# EAGLE design GPSModule (EAGLE 6.3)
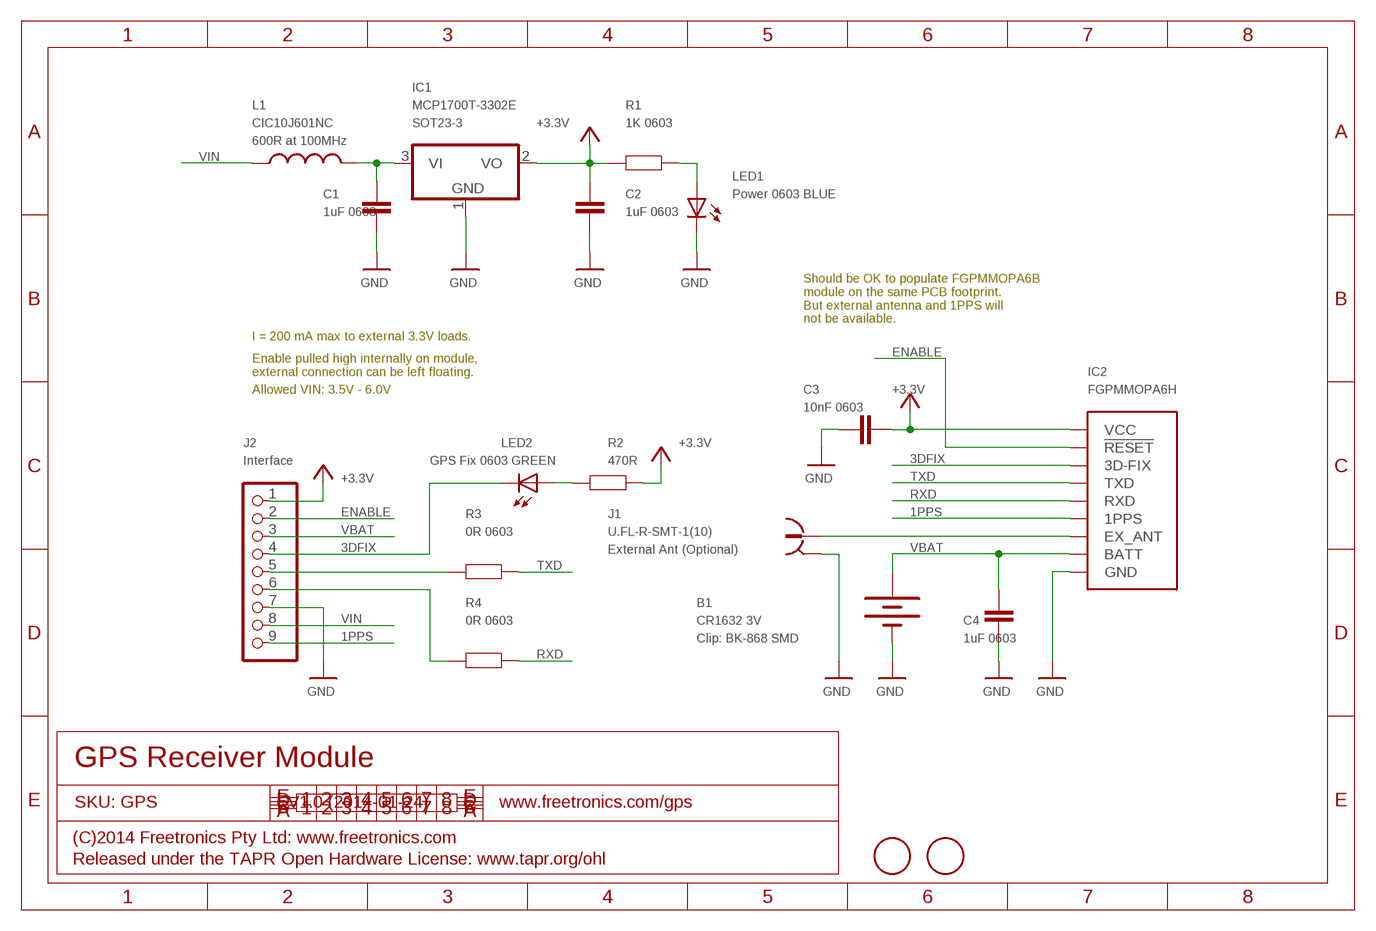
[diagram p0: schematic, sheet 1]

## Parts
B1  CR1632 3V  BATTERY  [BATCON_16MM]
C1  1uF 0603  CAP0603  [0603]
C2  1uF 0603  CAP0603  [0603]
C3  10nF 0603  CAP0603  [0603]
C4  1uF 0603  CAP0603  [0603]
FD1  FIDUCIAL  [FIDUCIAL_1MM]
FD2  FIDUCIAL  [FIDUCIAL_1MM]
IC1  MCP1700T-3302E  MCP1703CB  [SOT23]
IC2  FGPMMOPA6H  GPS  [GPS]
J1  U.FL-R-SMT-1(10)  UFL  [UFL]
J2  Interface  PINHD-1X9  [1X09]
L1  600R at 100MHz  INDUCTOR0603  [0603]
LED1  Power 0603 BLUE  LED0603  [LED-0603]
LED2  GPS Fix 0603 GREEN  LED0603  [LED-0603]
R1  1K 0603  RESISTOR0603  [0603]
R2  470R  RESISTOR0603  [0603]
R3  0R 0603  RESISTOR0603  [0603]
R4  0R 0603  RESISTOR0603  [0603]

## Nets
1PPS: IC2.13(1PPS) J2.9
3DFIX: IC2.5(3D-FIX) J2.4 LED2.C
+3V3: C2.2 C3.1 IC1.2(VO) IC2.1(VCC) J2.1 R1.2 R2.1 ; supply symbol labelled +3.3V
ENABLE: IC2.2(!RESET) J2.2
GND: B1.GND(-) C1.1 C2.1 C3.2 C4.1 IC1.1(GND) IC2.3(GND) IC2.8(GND) IC2.12(GND) IC2.19(GND) J1.GND J1.GND@1(GND) J2.7 LED1.C
N$1: J2.5 R3.2
N$2: IC2.11(EX_ANT) J1.SIG
N$3: LED1.A R1.1
N$4: LED2.A R2.2
N$5: C1.2 IC1.3(VI) L1.2
N$40: J2.6 R4.2
RXD: IC2.10(RXD) R4.1
TXD: IC2.9(TXD) R3.1
VBAT: B1.PWR@1(+) C4.2 IC2.4(BATT) J2.3
VIN: J2.8 L1.1

## Notes on the sheet
- Should be OK to populate FGPMMOPA6B
  module on the same PCB footprint.
  But external antenna and 1PPS will
  not be available.
- I = 200 mA max to external 3.3V loads.
- Enable pulled high internally on module,
  external connection can be left floating.
- Allowed VIN: 3.5V - 6.0V
- GPS Receiver Module
- SKU: GPS | V1.0 (2014-01-24) | www.freetronics.com/gps
- (C)2014 Freetronics Pty Ltd: www.freetronics.com
- Released under the TAPR Open Hardware License: www.tapr.org/ohl

## Library data of the parts
B1 = freetronics-master-v1:BATTERY: Battery Holders Various common sizes : AA, AAA, 20mm coin cell and 12mm coin cell.; FOO: Clip: BK-868 SMD
C1-C4 = freetronics-master-v1:CAP: Capacitor Standard 0603 ceramic capacitor, and 0.1" leaded capacitor.; PACKAGE: 0603
FD1 FD2 = adafruit:FIDUCIAL: For use by pick and place machines to calibrate the vision/machine, 1mm By microbuilder.eu
IC1 = linear:MCP1703: 250 mA, 16V, Low Quiescent Current LDO Regulator Source: http://ww1.microchip.com/downloads/en/DeviceDoc/22049b.pdf; PACKAGE: SOT23-3
IC2 = freetronics-luke:GPS
J1 = freetronics-luke:UFL: U.FL RF connector; NOTE: External Ant (Optional)
J2 = pinhead:PINHD-1X9: PIN HEADER
L1 = freetronics-master-v1:INDUCTOR: Inductors Basic Inductor/Choke - 0603 and 1206. Footprints are not proven and vary greatly between part numbers.; ID: CIC10J601NC
LED1 = freetronics-master-v1:LED: LEDs Standard schematic elements and footprints for 5mm, 3mm, 1206, and 0603 sized LEDs. 5mm - Spark Fun Electronics SKU : COM-00529 (and others); COLOUR: Blue; PACKAGE: 0603
LED2 = freetronics-master-v1:LED: LEDs Standard schematic elements and footprints for 5mm, 3mm, 1206, and 0603 sized LEDs. 5mm - Spark Fun Electronics SKU : COM-00529 (and others); COLOUR: Green; PACKAGE: 0603
R1-R4 = freetronics-master-v1:RESISTOR: Resistor Basic schematic elements and footprints for 0603, 1206, and PTH 1/10th watt (small) resistors.; PACKAGE: 0603

## Board
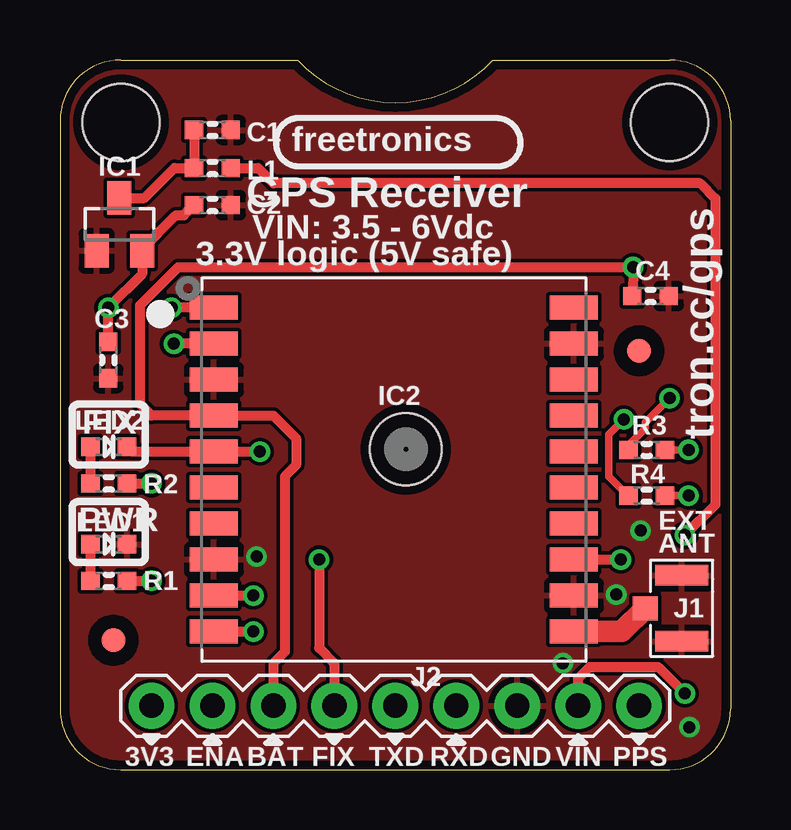
[diagram p1: board, top side]
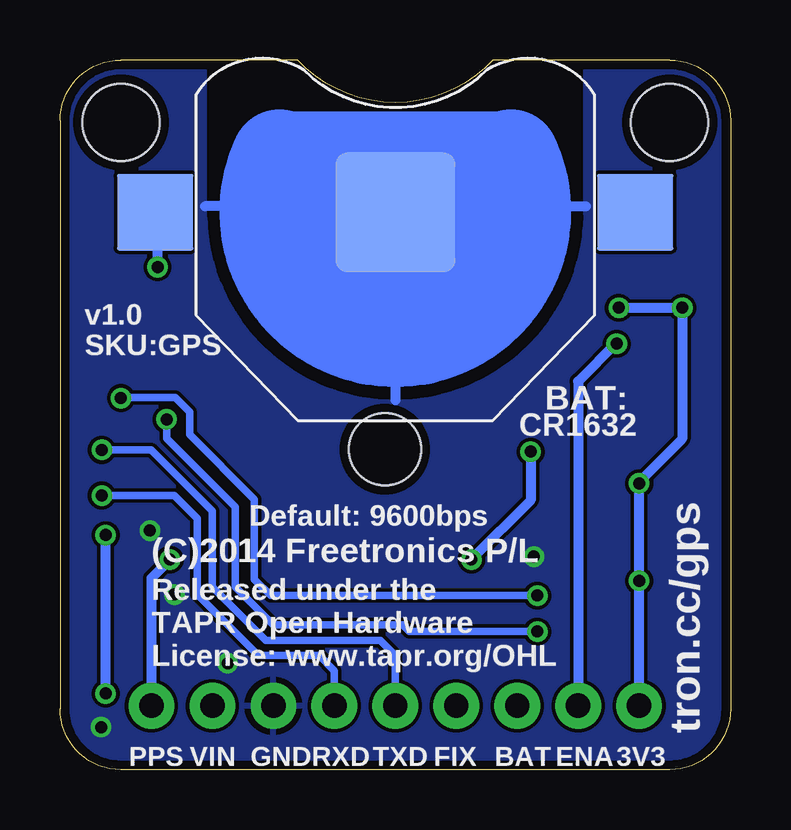
[diagram p2: board, bottom side, seen from below]

Size 27.94 x 29.59 mm. Coordinates in mm from the lower left corner, seen from the top.
Outline: 0,2.54 arc90 2.54,0 25.4,0 arc90 27.94,2.54 27.94,27.05 arc90 25.4,29.59 18.03,29.59 arc-47 13.97,27.81 arc-47 9.91,29.59 2.54,29.59 arc90 0,27.05 0,2.54
Copper layers (1*16): Top 0.0356mm / dielectric 1.5011mm / Bottom 0.0356mm
Design rules "LaenPCBOrder *": minimum track width 6mil, minimum drill 13mil, track to track 6mil, track to pad 6mil, pad to pad 6mil, via to via 6mil, smd to smd 6mil, copper to edge 15mil, drill to drill 6mil, minimum pad ring 7mil, minimum via ring 7mil, stop-mask expansion 4mil, vias tented up to drill 16mil, thermal gap 10mil
Holes 3.2 mm at 25.4,26.99 2.54,26.99
bRestrict: area 6.2,23 to 21.8,29.6; 1 lines

### Footprints (pad centres in the part's own frame; a part is rotated, then mirrored left to right if it is on the bottom)
BATCON_16MM = smd 5 x 5: GND 0,0 | smd 3.175 x 3.175: PWR@1 -10,0; PWR@2 10,0
0603 = smd 0.762 x 0.762: 1 -0.762,0; 2 0.762,0
FIDUCIAL_1MM = smd 1 x 1: 1 0,0
SOT23 = smd 1 x 1.4: 1 -0.95,-1.1; 2 0.95,-1.1; 3 0,1.1
GPS = smd 2 x 1: 1 -7.5,6.75; 2 -7.5,5.25; 3 -7.5,3.75; 4 -7.5,2.25; 5 -7.5,0.75; 6 -7.5,-0.75; 7 -7.5,-2.25; 8 -7.5,-3.75; 9 -7.5,-5.25; 10 -7.5,-6.75; 11 7.5,-6.75; 12 7.5,-5.25; 13 7.5,-3.75; 14 7.5,-2.25; 15 7.5,-0.75; 16 7.5,0.75; 17 7.5,2.25; 18 7.5,3.75; 19 7.5,5.25; 20 7.5,6.75 | hole 3: 0.5,0.85
UFL = smd 2.2 x 0.85: GND 0,1.375; GND@1 0,-1.375 | smd 1.05 x 1: SIG -1.525,0
1X09 = drill 1.016 pad 1.905: 1 -10.16,0; 2 -7.62,0; 3 -5.08,0; 4 -2.54,0; 5 0,0; 6 2.54,0; 7 5.08,0; 8 7.62,0; 9 10.16,0
LED-0603 = smd 0.762 x 0.762: A -0.762,0; C 0.762,0

### Placement (x,y rotation side)
B1  13.97,23.24 0 bottom
C1  6.35,26.67 180 top
C2  6.35,23.54 180 top
C3  2.01,17.08 270 top
C4  24.61,19.75 180 top
FD1  2.22,5.4 0 top
FD2  24.13,17.46 0 top
IC1  2.48,22.73 0 top
IC2  13.91,12.51 0 top
J1  25.91,6.73 0 top
J2  13.97,2.67 0 top
L1  6.35,25.08 180 top
LED1  2.03,9.4 0 top
LED2  2.03,13.46 0 top
R1  2.03,7.87 0 top
R2  2.03,11.94 180 top
R3  24.45,13.34 0 top
R4  24.45,11.43 0 top

### Tracks (layer width: path | path; a pad name or v marks a point on that pad's centre or on a via)
1PPS  (via drill 0.5)
  Top 0.406: IC2.13 v23.36,8.76
  Bottom 0.406: v23.36,8.76 23.36,8.74 24.13,7.98 J2.9
3DFIX  (via drill 0.5)
  Top 0.406: v8.33,13.26 IC2.5 3,13.26 LED2.C | v10.79,8.76 10.79,5.08 11.43,4.45 J2.4
  Bottom 0.406: v8.33,13.26 8.33,11.23 v10.79,8.76
+3V3  (via drill 0.5)
  Top 0.406: IC2.1 v4.65,19.26 | R1.2 v3.81,7.87 | R2.1 v3.81,11.94 | C3.1 v2.01,19.26 3.43,20.67 IC1.2 3.43,21.71 4.83,23.11 5.17,23.11 C2.2 5.55,23.5
  Bottom 0.406: v4.65,19.26 v2.01,19.26 2.01,13.8 3.81,12 v3.81,11.94 v3.81,7.87 J2.1
ENABLE  (via drill 0.5)
  Top 0.406: IC2.2 v4.74,17.76
  Bottom 0.406: v4.74,17.76 4.74,17.8 6.35,16.19 J2.2
GND  (via drill 0.5 pad 0.33)
  Bottom 0.254: 19.05,20.19 19.05,21.72 17.02,23.75
  Bottom 0.406: 9.14,25.53 10.92,23.75 | 10.92,23.75 13.21,23.75 | 18.8,25.53 17.02,23.75 | 10.92,23.75 10.41,23.75 10.16,23.5 13.72,23.5 B1.GND | 19.05,20.19 16.07,20.19 14.61,18.73 13.97,18.73 | 13.97,18.73 13.97,15.4 | 13.97,18.73 13.97,23.5 | 13.97,23.5 21.91,23.5 | 13.97,23.5 6.03,23.5
  Bottom 4: 9.14,25.53 arc230 18.8,25.53
  other vias: 24.19,9.97 23.18,7.3 20.95,4.45 26.23,1.78 8.19,8.89
  pour Top: 2.54,29.59 arc90 0,27.05 0,2.54 arc90 2.54,0 25.4,0 arc90 27.94,2.54 27.94,27.05 arc90 25.4,29.59 18.03,29.59 16.76,28.57 15.75,28.07 arc-31 14.48,27.81 arc8 13.46,27.81 arc-31 12.19,28.07 10.67,28.83 9.91,29.59
  pour Bottom: 2.54,29.59 arc90 0,27.05 0,2.54 arc90 2.54,0 25.4,0 arc90 27.94,2.54 27.94,27.05 arc90 25.4,29.59 18.03,29.59 16.76,28.57 15.75,28.07 arc-31 14.48,27.81 arc8 13.46,27.81 arc-31 12.19,28.07 10.67,28.83 9.91,29.59
N$1  (via drill 0.5)
  Top 0.305: R3.2 v26.19,13.34
  Bottom 0.305: v26.19,13.34 24.13,13.34 21.59,10.79 21.59,7.62 19.37,5.4 14.61,5.4 13.97,4.76 J2.5
N$2
  Top 0.889: IC2.11 23.41,5.76 J1.SIG
N$3
  Top 0.406: LED1.A R1.1
N$4
  Top 0.406: LED2.A R2.2
N$5
  Top 0.406: C1.2 L1.2 4.76,25.08 3.51,23.83 IC1.3
N$40  (via drill 0.5)
  Top 0.305: R4.2 v26.19,11.43
  Bottom 0.305: v26.19,11.43 23.18,11.43 22.23,10.48 22.23,7.3 19.68,4.76 17.14,4.76 16.51,4.13 J2.6
RXD  (via drill 0.5)
  Top 0.305: R4.1 23.65,11.43 22.86,12.22 22.86,13.97 v23.5,14.61
  Top 0.406: IC2.10 v8.05,5.76
  Bottom 0.305: v23.5,14.61 23.5,13.81 20.64,10.95 20.64,7.62 19.05,6.03 13.65,6.03 13.38,5.76 v8.05,5.76
TXD  (via drill 0.5)
  Top 0.305: R3.1 23.69,13.53 24.38,14.22 24.38,14.48 v25.4,15.49
  Top 0.406: IC2.9 v8.05,7.26
  Bottom 0.305: v8.05,7.26 19.17,7.26 19.84,7.94 19.84,11.27 22.54,13.97 22.54,14.92 23.15,15.53 25.37,15.53 v25.4,15.49
VBAT  (via drill 0.5)
  Top 0.406: J2.3 8.89,4.45 9.37,4.92 9.37,12.22 9.84,12.7 9.84,13.81 8.89,14.76 IC2.4 3.81,14.76 3.33,15.24 3.33,19.37 4.92,20.95 v23.88,20.95 23.91,20.95 C4.2
  Bottom 0.406: B1.PWR@1 v23.88,20.95
VIN  (via drill 0.5)
  Top 0.406: v26.04,9.78 27.3,11.05 27.3,23.81 26.67,24.45 8.89,24.45 8.26,25.08 L1.1 | J2.8 21.59,3.81 22.07,4.29 24.92,4.29 v26.04,3.17
  Bottom 0.406: v26.04,3.17 v26.04,9.78
(copper drawn outside any net)
  shapes: Bottom area x1

### Text on the board
tPlace: freetronics | GPS Receiver | VIN: 3.5 - 6Vdc | 3.3V logic (5V safe) | FIX | tron.cc/gps | PWR | EXT | ANT | 3V3 | ENA | BAT | FIX | TXD | RXD | GND | VIN | PPS
bPlace: v1.0 | SKU:GPS | BAT: | CR1632 | Default: 9600bps | (C)2014 Freetronics P/L | Released under the / TAPR Open Hardware / License: www.tapr.org/OHL | tron.cc/gps | 3V3 | ENA | BAT | FIX | TXD | RXD | GND | VIN | PPS